# EAGLE schematic Esquema20 (EAGLE 7.2.0)
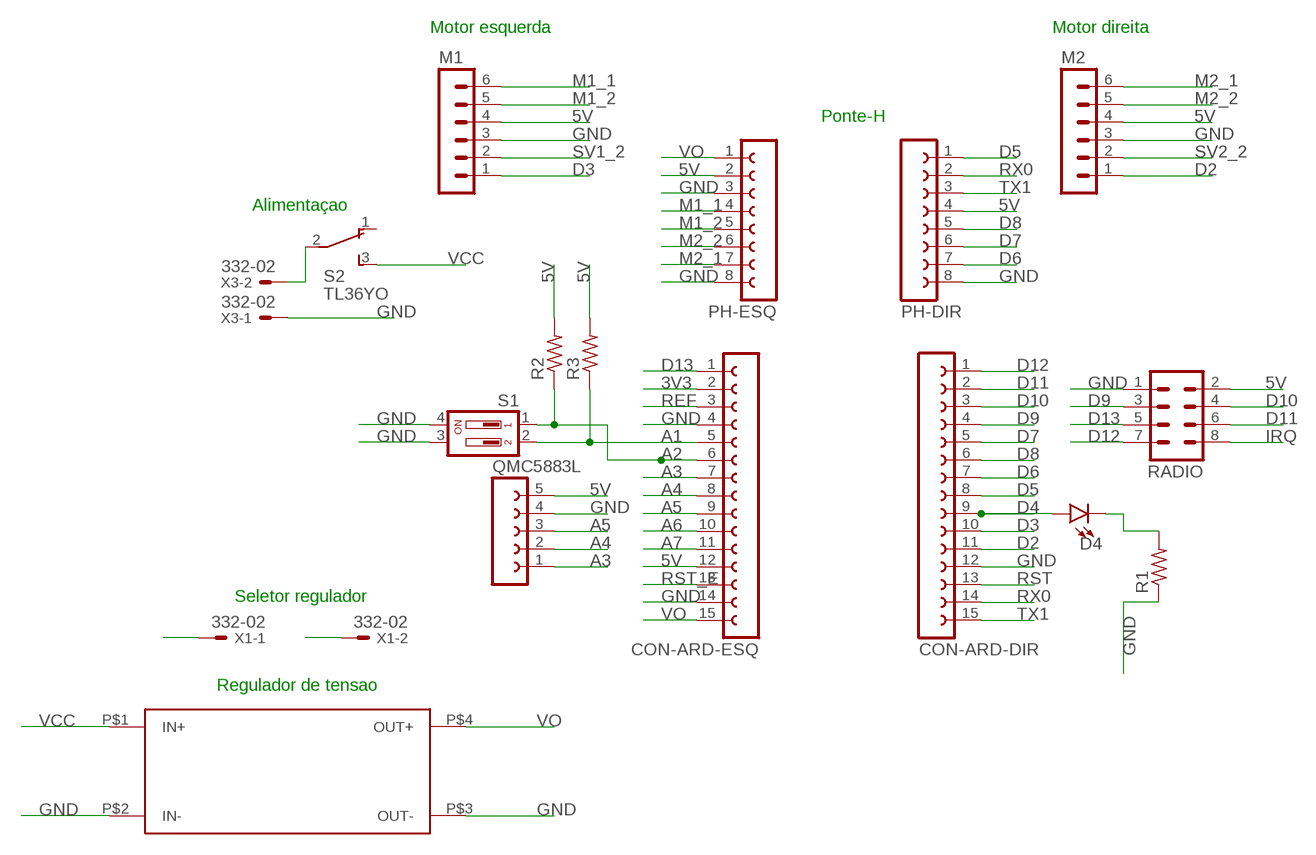
[diagram p0: schematic, sheet 1]

## Parts
CON-ARD-DIR  FE15-1  [FE15]
CON-ARD-ESQ  FE15-1  [FE15]
D4  LED-3MM-NO_SILK  [LED_3MM-NS]
M1  MA06-1  [MA06-1]
M2  MA06-1  [MA06-1]
PH-DIR  FE08-1  [FE08]
PH-ESQ  FE08-1  [FE08]
QMC5883L  FE05W  [FE05W]
R1  R-US_0207/12  [0207/12]
R2  R-US_0207/12  [0207/12]
R3  R-US_0207/12  [0207/12]
RADIO  MA04-2  [MA04-2]
S1  DA02  [DA-02]
S2  TL36YO  [TL3XYO]
U$1  REGULADOR  [REGULADOR-FP]
X1  332-02  [332-02]
X3  332-02  [332-02]

## Nets
3V3: CON-ARD-ESQ.2
5V: CON-ARD-ESQ.12 M1.4 M2.4 PH-DIR.4 PH-ESQ.2 QMC5883L.5 R2.2 R3.2 RADIO.2
A1: CON-ARD-ESQ.5 R3.1 S1.2
A2: CON-ARD-ESQ.6 R2.1 S1.1
A3: CON-ARD-ESQ.7 QMC5883L.1
A4: CON-ARD-ESQ.8 QMC5883L.2
A5: CON-ARD-ESQ.9 QMC5883L.3
A6: CON-ARD-ESQ.10
A7: CON-ARD-ESQ.11
D2: CON-ARD-DIR.11 M2.1
D3: CON-ARD-DIR.10 M1.1
D4: CON-ARD-DIR.9 D4.A
D5: CON-ARD-DIR.8 PH-DIR.1
D6: CON-ARD-DIR.7 PH-DIR.7
D7: CON-ARD-DIR.5 PH-DIR.6
D8: CON-ARD-DIR.6 PH-DIR.5
D9: CON-ARD-DIR.4 RADIO.3
D10: CON-ARD-DIR.3 RADIO.4
D11: CON-ARD-DIR.2 RADIO.6
D12: CON-ARD-DIR.1 RADIO.7
D13: CON-ARD-ESQ.1 RADIO.5
GND: CON-ARD-DIR.12 CON-ARD-ESQ.4 CON-ARD-ESQ.14 M1.3 M2.3 PH-DIR.8 PH-ESQ.3 PH-ESQ.8 QMC5883L.4 R1.1 RADIO.1 S1.3 S1.4 U$1.P$2(IN-) U$1.P$3(OUT-) X3.1
IRQ: RADIO.8
M1_1: M1.6 PH-ESQ.4
M1_2: M1.5 PH-ESQ.5
M2_1: M2.6 PH-ESQ.7
M2_2: M2.5 PH-ESQ.6
N$1: S2.2(P) X3.2
N$5: D4.K(C) R1.2
REF: CON-ARD-ESQ.3
RST: CON-ARD-DIR.13
RST_E: CON-ARD-ESQ.13
RX0: CON-ARD-DIR.14 PH-DIR.2
SV1_2: M1.2
SV2_2: M2.2
TX1: CON-ARD-DIR.15 PH-DIR.3
VCC [VCC]: S2.3(S) U$1.P$1(IN+) X1.1
VO: CON-ARD-ESQ.15 PH-ESQ.1 U$1.P$4(OUT+) X1.2
Unconnected: S2.1(O)

## Notes on the sheet
- Motor esquerda | Motor direita
- Ponte-H
- Alimentaçao
- Seletor regulador
- Regulador de tensao

## Library data of the parts
CON-ARD-DIR = con-lsta:FE15-1: FEMALE HEADER; OC_FARNELL: unknown; OC_NEWARK: unknown
CON-ARD-ESQ = con-lsta:FE15-1: FEMALE HEADER; OC_FARNELL: unknown; OC_NEWARK: unknown; SPICEPREFIX: X
D4 = SparkFun-LED:LED: LED (Generic) Standard schematic elements and footprints for 5mm, 3mm, 1206, and 0603 sized LEDs. Generic LEDs with no color specified.
M1 M2 = con-lstb:MA06-1: PIN HEADER; OC_FARNELL: unknown; OC_NEWARK: unknown
PH-DIR PH-ESQ = con-lsta:FE08-1: FEMALE HEADER; OC_FARNELL: unknown; OC_NEWARK: unknown
QMC5883L = con-lsta:FE05W: FEMALE HEADER; OC_FARNELL: unknown; OC_NEWARK: unknown
R1-R3 = resistor:R-US_: RESISTOR, American symbol
RADIO = con-lstb:MA04-2: PIN HEADER; OC_FARNELL: unknown; OC_NEWARK: unknown
S1 = switch-dil:DA02: DIL/CODE SWITCH; OC_FARNELL: 1255229; OC_NEWARK: unknown
S2 = switch:TL36YO: TINY SWITCH ON - ON Source: http://www2.produktinfo.conrad.com/datenblaetter/700000-724999/705152-da-01-de-Subminiaturschalter_TL_36YO.pdf
U$1 = robo-bdp:REGULADOR
X1 X3 = con-garry:332-02: 2 Pin - 2mm Dual Row Source: www.mpe-connector.de / garry_shortform_2012.pdf

## Net classes
0 default: width 1 mm
1 VCC: width 1 mm